# Altium schematic sheet 3V8 Power Regulator.SchDoc: 3V8 Power Regulator
size 292 x 193 mm; SheetNumber: 3; SheetTotal: 15
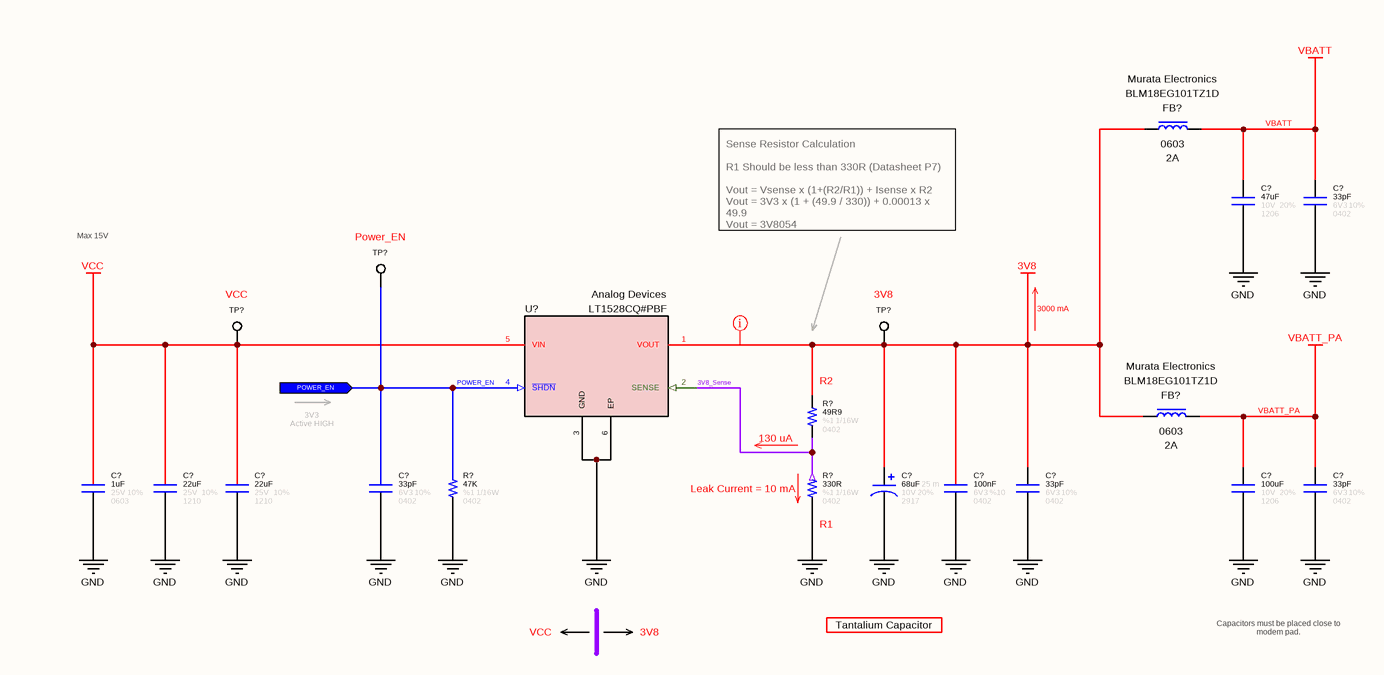
[diagram p0: 3V8 Power Regulator.SchDoc]

## Parts
(Parts that share a designator on the sheet are numbered #1, #2 ... from top to bottom, then left to right.)
C?#1  value 47uF  Tolerance: 20%  Case: 1206  Voltage: 10V  [CAPACITOR_1206]  (hidden comment: Capacitor - 47uF [1206] (Ceramic))
C?#2  value 33pF  Tolerance: 10%  Case: 0402  Voltage: 6V3  [CAPACITOR_0402]  (hidden comment: Capacitor - 33pF [0402] (Ceramic))
C?#3  value 1uF  Tolerance: 10%  Case: 0603  Voltage: 25V  [CAPACITOR_0402]  (hidden comment: Capacitor - 1uF [0603] (Ceramic))
C?#4  value 22uF  Tolerance: 10%  Case: 1210  Voltage: 25V  [CAPACITOR_0603]  (hidden comment: Capacitor - 22uF [1210] (Ceramic))
C?#5  value 22uF  Tolerance: 10%  Case: 1210  Voltage: 25V  [CAPACITOR_0603]  (hidden comment: Capacitor - 22uF [1210] (Ceramic))
C?#6  value 33pF  Tolerance: 10%  Case: 0402  Voltage: 6V3  [CAPACITOR_0402]  (hidden comment: Capacitor - 33pF [0402] (Ceramic))
C?#7  value 68uF  ESR: 25 m  Tolerance: 20%  Case: 2917  Voltage: 10V  [CAP_10TPE68M]  (hidden comment: Capacitor - 68uF [2917] (Tantalum))
C?#8  value 100nF  Tolerance: %10  Voltage: 6V3  Case: 0402  [CAPACITOR_0402]  (hidden comment: Capacitor - 100nF [0402] (Ceramic))
C?#9  value 33pF  Tolerance: 10%  Case: 0402  Voltage: 6V3  [CAPACITOR_0402]  (hidden comment: Capacitor - 33pF [0402] (Ceramic))
C?#10  value 100uF  Tolerance: 20%  Case: 1206  Voltage: 10V  [CAPACITOR_1206]  (hidden comment: Capacitor - 100uF [1206] (Ceramic))
C?#11  value 33pF  Tolerance: 10%  Case: 0402  Voltage: 6V3  [CAPACITOR_0402]  (hidden comment: Capacitor - 33pF [0402] (Ceramic))
FB?#1  Maximum DC Current: 2A  Case: 0603  Manufacturer Part Number: BLM18EG101TZ1D  Manufacturer Name: Murata Electronics  [INDUCTOR_0603]  (hidden comment: Ferrite Bead)
FB?#2  Maximum DC Current: 2A  Case: 0603  Manufacturer Part Number: BLM18EG101TZ1D  Manufacturer Name: Murata Electronics  [INDUCTOR_0603]  (hidden comment: Ferrite Bead)
R?#1  value 49R9  Case: 0402  Tolerance: %1  Power: 1/16W  [RESISTOR_0402]  (hidden comment: 49R9 - 0402 - %1 - 1/16W)
R?#2  value 47K  Tolerance: %1  Case: 0402  Power: 1/16W  [RESISTOR_0402]  (hidden comment: 47K - 0402 - %1 - 1/16W)
R?#3  value 330R  Case: 0402  Tolerance: %1  Power: 1/16W  [RESISTOR_0402]  (hidden comment: 330R - 0402 - %1 - 1/16W)
TP?#1  Power_EN  [TP]  (no BOM)
TP?#2  VCC  [TP]  (no BOM)
TP?#3  3V8  [TP]  (no BOM)
U?  Manufacturer Part Number: LT1528CQ#PBF  Manufacturer Name: Analog Devices  [DDPAK-5]  (hidden comment: LDO Regulator)

## Ports
POWER_EN (in)

## Nets
3V8: C?#7.1 C?#8.2 C?#9.2 FB?#1.1 FB?#2.1 R?#1.2 TP?#3.1 U?.1(VOUT)
GND: C?#1.1 C?#2.1 C?#3.1 C?#4.1 C?#5.1 C?#6.1 C?#7.2 C?#8.1 C?#9.1 C?#10.1 C?#11.1 R?#2.1 R?#3.1 U?.3(GND) U?.6(EP)
VBATT: C?#1.2 C?#2.2 FB?#1.2
VBATT_PA: C?#10.2 C?#11.2 FB?#2.2
VCC: C?#3.2 C?#4.2 C?#5.2 TP?#2.1 U?.5(VIN)
3V8_Sense: R?#1.1 R?#3.2 U?.2(SENSE)
POWER_EN: C?#6.2 R?#2.2 TP?#1.1 U?.4(~{SHDN}) ; port POWER_EN

## Layout directives
rule Supply Nets [Voltage = 3.800]: 3V8

## Notes on the sheet
- Sense Resistor Calculation
  R1 Should be less than 330R (Datasheet P7)
  Vout = Vsense x (1+(R2/R1)) + Isense x R2
  Vout = 3V3 x (1 + (49.9 / 330)) + 0.00013 x 49.9
  Vout = 3V8054
- Max 15V
- (near R?#1) R2
- 3000 mA
- 3V3
  Active HIGH
- (near R?#1) 130 uA
- (near R?#3) Leak Current = 10 mA
- (near R?#3) R1
- VCC
- 3V8
- Tantalium Capacitor
- Capacitors must be placed close to modem pad.
- © 2022 All rights reserved.
  This document may not, in whole or in part, be copied, photocopied, reproduced, translated or converted to any electronic or machine readable from without prior written permission of Mehmet Günce Akkoyun.
  Engineer contact : akkoyun@me.com
- Property of
- Engineer :
- Date :
- Size :
- A4
- Time :
- Project :
- Page :
- /
- Customer :
- Product ID :
- Module ID :
- Version :
- File :
- Revision :

## Library data of the parts
C?#1 = Capacitor - 47uF [1206-10V]: Multilayer Ceramic Capacitors MLCC - SMD/SMT 47UF 10V 20% 1206; Manufacturer Part Number: C1206C476M8PAC; Manufacturer Name: Kemet
C?#2 C?#6 C?#9 C?#11 = Capacitor - 33pF [0402-6V3]: Manufacturer Name: Kemet; Manufacturer Part Number: C0402C330J9RACAUTO; ComponentLink1Description: DataSheet; ComponentLink1URL: https://api.kemet.com/component-edge/download/datasheet/C0402C330J9RACAUTO.pdf; ComponentLink2Description: Mouser; ComponentLink2URL: https://www.mouser.com/Search/Refine.aspx?Keyword=80-C0402C330J9RAUTO
C?#3 = Capacitor - 1uF [0603-25V]: Multilayer Ceramic Capacitors - SMD - 25V 1uF X7R 0603 10%; Manufacturer Part Number: GCJ188R71E105KA01D; Manufacturer Name: Murata
C?#4 C?#5 = Capacitor - 22uF [1210-6V3]: Multilayer Ceramic Capacitors MLCC - SMD/SMT 22UF 25V 10% 1210; Manufacturer Part Number: GRM32ER71E226KE15L; Manufacturer Name: Murata
C?#7 = Capacitor - 68uF [2917-10V] (Tantalium): Tantalum Capacitors - Polymer 10V 68uF 2917 20% ESR=25mOhms; Manufacturer Name: Panasonic; Manufacturer Part Number: 10TPE68M
C?#8 = Capacitor - 100nF [0402-6V3]: Capacitor - 100nF [0402-6V3] (Ceramic); Manufacturer Name: AVX; Manufacturer Part Number: 04026D104KAT4A; ComponentLink1Description: Mouser; ComponentLink1URL: https://www.mouser.com.tr/ProductDetail/AVX/04026D104KAT4A?qs=sGAEpiMZZMs0AnBnWHyRQPg4iYkCw7IMED%2F4kpqgf7w%3D; ComponentLink2Description: DataSheet; ComponentLink2URL: https://www.mouser.com.tr/datasheet/2/40/cx5r-776519.pdf
C?#10 = Capacitor - 100uF [1206-10V]: Multilayer Ceramic Capacitors MLCC - SMD/SMT 100UF 10V 20% 1206; Manufacturer Part Number: GRM31CR61A107MEA8L; Manufacturer Name: Murata
FB?#1 FB?#2 = Inductor - Ferrite Bead [SMD]: Ferrite Beads 0603 100ohms 2000mA Auto Infotainment; Maximum DC Resistance: 45 mOhms; Tolerance: 25%; Value: BLM18EG101TZ1D; Height: 0.75mm; Maximum Operating Temperature: + 125; Minimum Operating Temperature: -55
R?#1 = Resistor - 49R9 [0402]: Thick Film Resistors - SMD 1/16 W 49.9 Ohm 1%; Manufacturer Name: Vishay; Manufacturer Part Number: CRCW040249R9FKED; ComponentLink1Description: DataSheet; ComponentLink1URL: https://www.mouser.com.tr/datasheet/2/427/dcrcwe3-1762152.pdf; ComponentLink2Description: Mouser; ComponentLink2URL: https://www.mouser.com.tr/ProductDetail/Vishay-Dale/CRCW0402330RFKED?qs=sGAEpiMZZMu61qfTUdNhG2DpbjADlD3GGS6SwBlLi5Q%3D
R?#2 = Resistor - 47K [0402]: Thick Film Resistors - SMD 1/16 W 47 KOhm 1%; Manufacturer Name: Vishay; Manufacturer Part Number: CRCW040247K0FKED; ComponentLink1Description: DataSheet; ComponentLink1URL: https://www.mouser.com.tr/datasheet/2/427/dcrcwe3-1762152.pdf; ComponentLink2Description: Mouser; ComponentLink2URL: https://www.mouser.com.tr/ProductDetail/Vishay-Dale/CRCW040247K0FKED?qs=sGAEpiMZZMu61qfTUdNhG2DpbjADlD3GL%252B3h1elTxqU%3D
R?#3 = Resistor - 330R [0402]: Thick Film Resistors - SMD 1/16 W 330 Ohm 1%; Manufacturer Name: Vishay; Manufacturer Part Number: CRCW0402330RFKED; ComponentLink1Description: DataSheet; ComponentLink1URL: https://www.mouser.com.tr/datasheet/2/427/dcrcwe3-1762152.pdf; ComponentLink2Description: Mouser; ComponentLink2URL: https://www.mouser.com.tr/ProductDetail/Vishay-Dale/CRCW0402330RFKED?qs=sGAEpiMZZMu61qfTUdNhG2DpbjADlD3GGS6SwBlLi5Q%3D
TP?#1-TP?#3 = PCB - Test Point: Test Point
U? = IC - LT1528CQ: LDO Voltage Regulators 3A L Drop Reg for uP Applications; Height: 1.45mm; Case: DDPAK-5